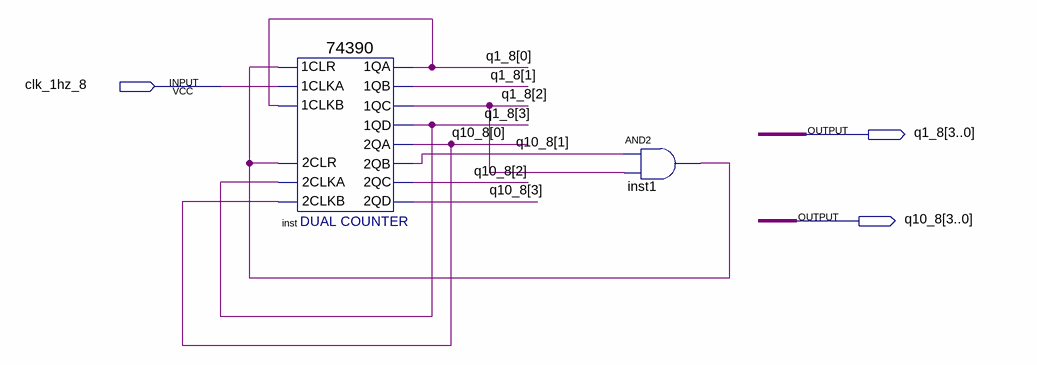
[diagram p0: schematic sheet]
// Quartus schematic m24_8.bdf as structural Verilog: 2 symbols, 3 pins
module m24_8 (
  input  clk_1hz_8,
  output [3:0] q1_8,
  output [3:0] q10_8
);

  wire inst1_out;

  \74390  inst (
    .\2CLKA (q1_8[3]), .\2CLR (inst1_out), .\2CLKB (q10_8[0]), .\1CLR (inst1_out), .\1CLKA (clk_1hz_8),
    .\1CLKB (q1_8[0]), .\1QA (q1_8[0]), .\1QB (q1_8[1]), .\1QC (q1_8[2]), .\1QD (q1_8[3]), .\2QA (q10_8[0]),
    .\2QB (q10_8[1]), .\2QC (q10_8[2]), .\2QD (q10_8[3]));
  and inst1 (inst1_out, q10_8[1], q1_8[2]);
endmodule
